# EAGLE schematic BoardA1-Changed connectors (EAGLE 8.2.1)
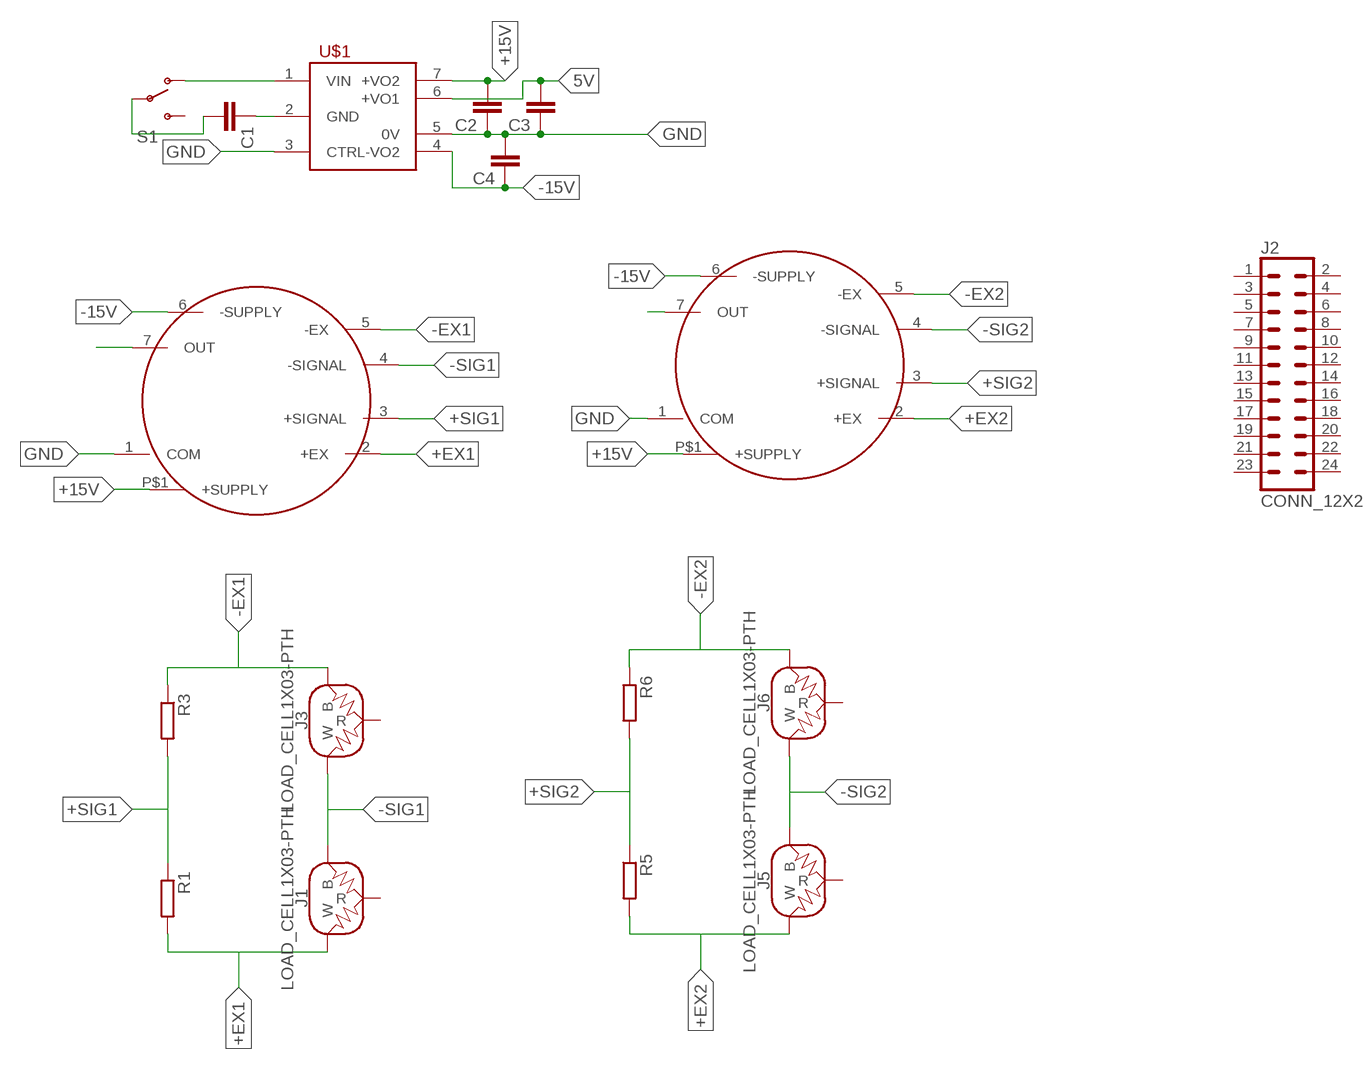
[diagram p0: schematic, sheet 1]

## Parts
C1  CAP0805  [0805]
C2  CAP0805  [0805]
C3  CAP0805  [0805]
C4  CAP0805  [0805]
J1  LOAD_CELL1X03-PTH  [1X03]
J2  CONN_12X2  [2X12]
J3  LOAD_CELL1X03-PTH  [1X03]
J5  LOAD_CELL1X03-PTH  [1X03]
J6  LOAD_CELL1X03-PTH  [1X03]
R1  R0204/7  [0204/7]
R3  R0204/7  [0204/7]
R5  R0204/7  [0204/7]
R6  R0204/7  [0204/7]
S1  SWITCH-SPDTPTH  [SWITCH-SPDT]
U$1  DC-DC  [DC-DCCONVERTER]
U$2  ICA3H  [ICA3H]
U$3  ICA3H  [ICA3H]

## Nets
5V: C3.2 U$1.6(+VO1)
+15V: C2.2 U$1.7(+VO2) U$2.P$1(+SUPPLY) U$3.P$1(+SUPPLY)
+EX1: J1.2(W) R1.2 U$2.2(+EX)
+EX2: J5.2(W) R5.2 U$3.2(+EX)
+SIG1: R1.1 R3.2 U$2.3(+SIGNAL)
+SIG2: R5.1 R6.2 U$3.3(+SIGNAL)
-15V: C4.1 U$1.4(-VO2) U$2.6(-SUPPLY) U$3.6(-SUPPLY)
-EX1: J3.1(B) R3.1 U$2.5(-EX)
-EX2: J6.1(B) R6.1 U$3.5(-EX)
-SIG1: J1.1(B) J3.2(W) U$2.4(-SIGNAL)
-SIG2: J5.1(B) J6.2(W) U$3.4(-SIGNAL)
GND: C2.1 C3.1 C4.2 U$1.3(CTRL) U$1.5(0V) U$2.1(COM) U$3.1(COM)
N$1: C1.2 S1.2(P)
N$2: C1.1 U$1.2(GND)
N$3: S1.1(O) U$1.1(VIN)
N$4: U$3.7(OUT)
N$5: U$2.7(OUT)
Unconnected: J1.3(R) J2.1 J2.2 J2.3 J2.4 J2.5 J2.6 J2.7 J2.8 J2.9 J2.10 J2.11 J2.12 J2.13 J2.14 J2.15 J2.16 J2.17 J2.18 J2.19 J2.20 J2.21 J2.22 J2.23 J2.24 J3.3(R) J5.3(R) J6.3(R) S1.3(S)

## Library data of the parts
C1-C4 = SparkFun-Capacitors:CAP: Capacitor Standard 0603 ceramic capacitor, and 0.1" leaded capacitor.
J1 J3 J5 J6 = Smartcrutches:LOAD_CELL: Load Cell - Half-Wheatstone Bridge Load cell weight sensors commonly found in scales. 3- pin, half-wheatstone bridge configuration. Datasheet <http://www.sparkfun.com/datasheets/Sensors/loadsensor.pdf> SparkFun Products Load Sensor - 50kg <https://www.sparkfun.com/products/10245> (SEN-10245); SF_ID: SEN-10245
J2 = Smartcrutches:CONN_12X2: Multi connection point. Often used as Generic Header-pin footprint for 0.1 inch spaced/style header connections On any of the 0.1 inch spaced packages, you can populate with these: Break Away Headers - Straight <https://www.sparkfun.com/products/116> (PRT-00116) Break Away Male Headers - Right Angle <https://www.sparkfun.com/products/553> (PRT-00553) Female Headers <https://www.sparkfun.com/products/115> (PRT-00115) Break Away Headers - Machine Pin <https://www.sparkfun.com/products/117> (PRT-00117) Break Away Female Headers - Swiss Machine Pin <https://www.sparkfun.com/products/743> (PRT-00743)
R1 R3 R5 R6 = eagle-ltspice:R: RESISTOR, European symbol; SPICEMODEL: NONE; SPICEPREFIX: R
S1 = SparkFun-Electromechanical:SWITCH-SPDT: SPDT Switch Simple slide switch, Spark Fun Electronics SKU : COM-00102 DPDT SMT slide switch, AYZ0202, SWCH-08179; PROD_ID: SWCH-08261
U$1 = Smartcrutches:DC-DC
U$2 U$3 = Smartcrutches:ICA3H